# EAGLE design programming-board-rpi4 (EAGLE 9.6.2)
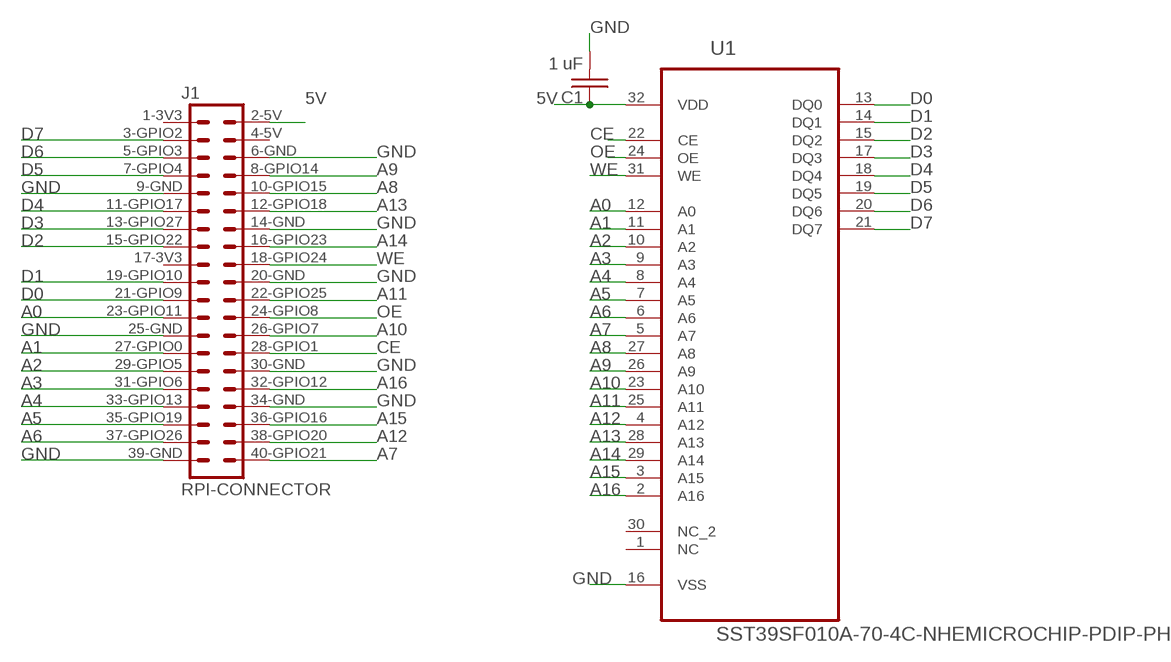
[diagram p0: schematic, sheet 1]

## Parts
C1  1 uF  C-USC1206K  [C1206K]
J1  RPI-CONNECTOR  [RPI-2X20]
U1  SST39SF010A-70-4C-NHEMICROCHIP-PDIP-PH  [DIP1574W53P254L4191H508Q32B]

## Nets
5V: C1.1 J1.2-5V(5V) U1.32(VDD)
A0: J1.23-GPIO11(GPIO11) U1.12(A0)
A1: J1.27-GPIO0(GPIO0) U1.11(A1)
A2: J1.29-GPIO5(GPIO5) U1.10(A2)
A3: J1.31-GPIO6(GPIO6) U1.9(A3)
A4: J1.33-GPIO13(GPIO13) U1.8(A4)
A5: J1.35-GPIO19(GPIO19) U1.7(A5)
A6: J1.37-GPIO26(GPIO26) U1.6(A6)
A7: J1.40-GPIO21(GPIO21) U1.5(A7)
A8: J1.10-GPIO15(GPIO15) U1.27(A8)
A9: J1.8-GPIO14(GPIO14) U1.26(A9)
A10: J1.26-GPIO7(GPIO7) U1.23(A10)
A11: J1.22-GPIO25(GPIO25) U1.25(A11)
A12: J1.38-GPIO20(GPIO20) U1.4(A12)
A13: J1.12-GPIO18(GPIO18) U1.28(A13)
A14: J1.16-GPIO23(GPIO23) U1.29(A14)
A15: J1.36-GPIO16(GPIO16) U1.3(A15)
A16: J1.32-GPIO12(GPIO12) U1.2(A16)
CE: J1.28-GPIO1(GPIO1) U1.22(CE)
D0: J1.21-GPIO9(GPIO9) U1.13(DQ0)
D1: J1.19-GPIO10(GPIO10) U1.14(DQ1)
D2: J1.15-GPIO22(GPIO22) U1.15(DQ2)
D3: J1.13-GPIO27(GPIO27) U1.17(DQ3)
D4: J1.11-GPIO17(GPIO17) U1.18(DQ4)
D5: J1.7-GPIO4(GPIO4) U1.19(DQ5)
D6: J1.5-GPIO3(GPIO3) U1.20(DQ6)
D7: J1.3-GPIO2(GPIO2) U1.21(DQ7)
GND: C1.2 J1.6-GND(GND) J1.9-GND(GND) J1.14-GND(GND) J1.20-GND(GND) J1.25-GND(GND) J1.30-GND(GND) J1.34-GND(GND) J1.39-GND(GND) U1.16(VSS)
OE: J1.24-GPIO8(GPIO8) U1.24(OE)
WE: J1.18-GPIO24(GPIO24) U1.31(WE)
Unconnected: U1.1(NC) U1.30(NC_2)

## Power pins joined to a net without a drawn wire
3V3: J1.1-3V3(3V3) J1.17-3V3(3V3)
5V: J1.4-5V(5V)

## Library data of the parts
C1 = passives:C-US: CAPACITOR, American symbol
J1 = hats:RPI-CONNECTOR: 0.1" spaced headers
U1 = memories:SST39SF010A-70-4C-NHE: 1MB Flash; DESCRIPTION: SST39SF Series 1 Mbit 128 K x 8 5 V Multi-Purpose Flash - PLCC-32; MP: SST39SF010A-70-4C-NHE

## Board
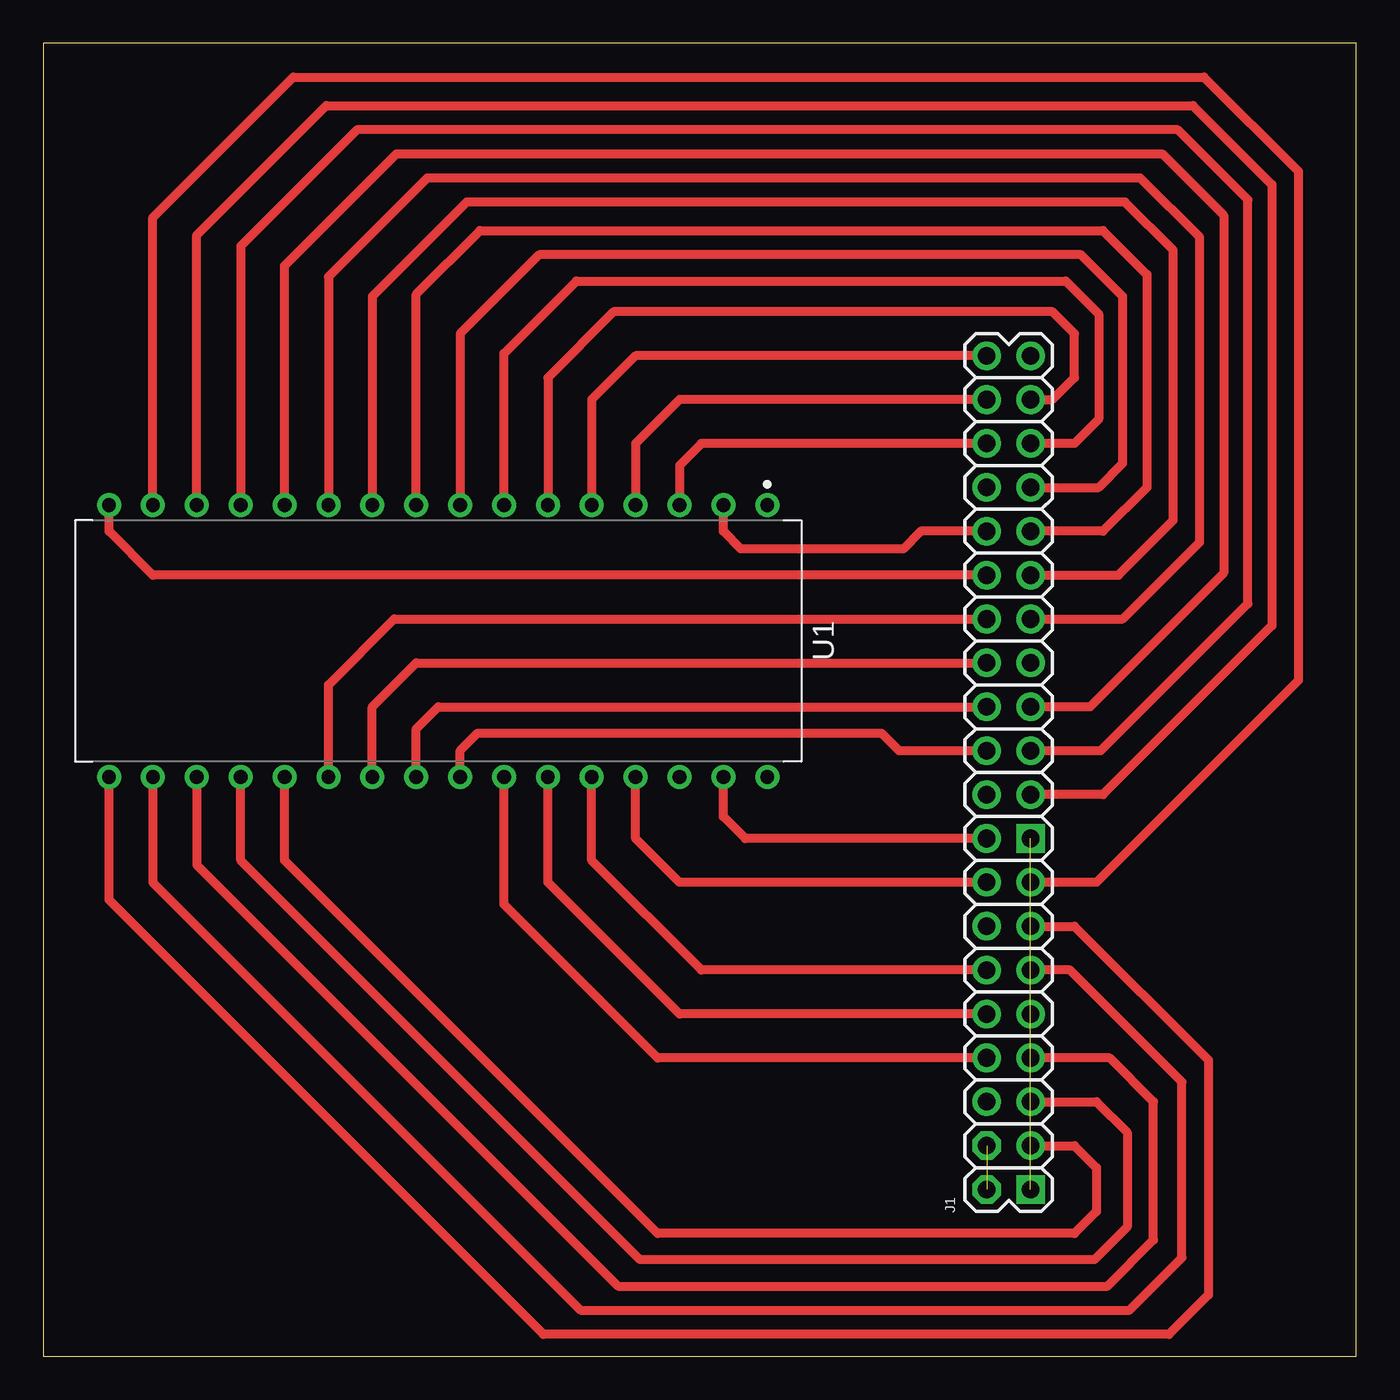
[diagram p1: board, top side]
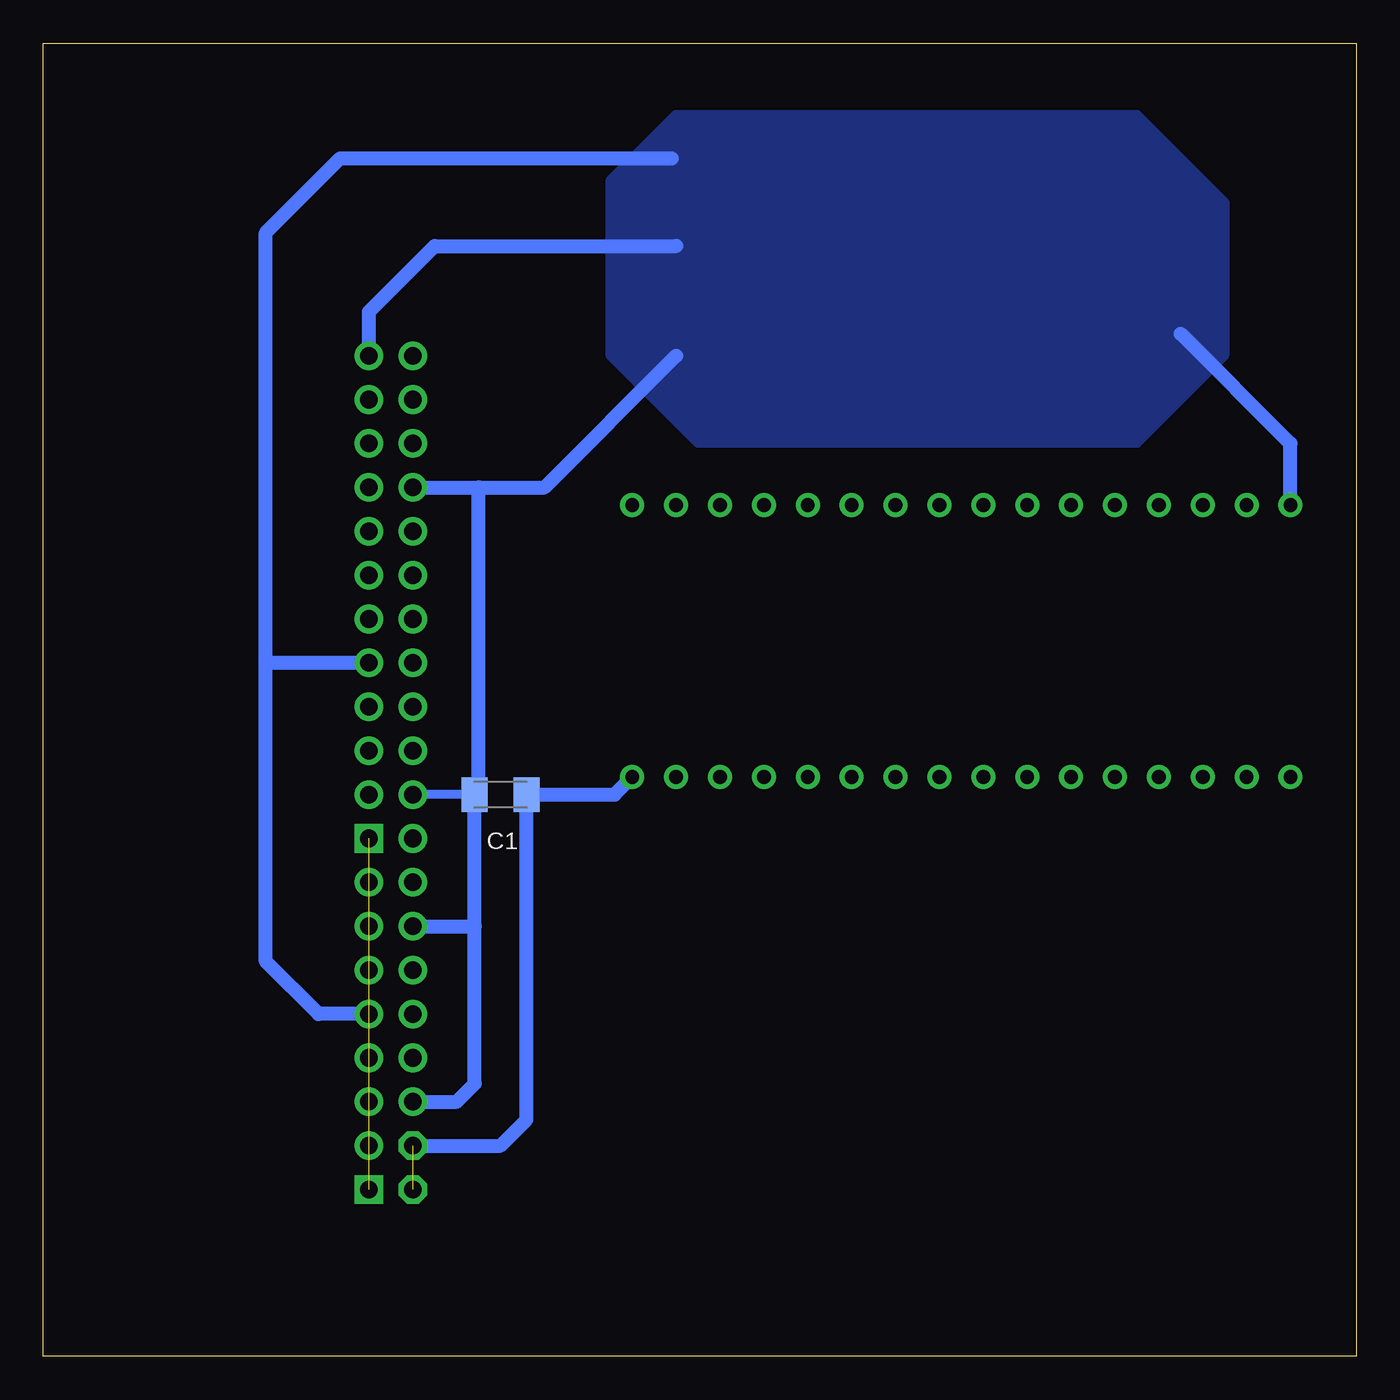
[diagram p2: board, bottom side, seen from below]

Size 76 x 76 mm. Coordinates in mm from the lower left corner, seen from the top.
Outline: 0,0 76,0 76,76 0,76 0,0
Copper layers (1*16): Top 0.035mm / dielectric 1.5mm / Bottom 0.035mm
Design rules "OthermillDRC_1_32_v2": minimum track width 8mil, minimum drill 0.8mm, track to track 0.794003125mm, track to pad 0.794003125mm, pad to pad 0.794003125mm, via to via 0.794003125mm, smd to smd 0mil, copper to edge 0mil, drill to drill 1mil, minimum pad ring 10mil, minimum via ring 10mil, stop-mask expansion 1mil, vias tented up to drill 30mil, thermal gap 10mil

### Footprints (pad centres in the part's own frame; a part is rotated, then mirrored left to right if it is on the bottom)
C1206K = smd 1.5 x 2: 1 -1.5,0; 2 1.5,0
RPI-2X20 = drill 1.016 pad 1.651 square: 1-3V3 -24.13,-1.27; 17-3V3 -3.81,-1.27 | drill 1.016 pad 1.651 octagon: 2-5V -24.13,1.27; 4-5V -21.59,1.27 | drill 1.016 pad 1.651: 3-GPIO2 -21.59,-1.27; 5-GPIO3 -19.05,-1.27; 6-GND -19.05,1.27; 7-GPIO4 -16.51,-1.27; 8-GPIO14 -16.51,1.27; 9-GND -13.97,-1.27; 10-GPIO15 -13.97,1.27; 11-GPIO17 -11.43,-1.27; 12-GPIO18 -11.43,1.27; 13-GPIO27 -8.89,-1.27; 14-GND -8.89,1.27; 15-GPIO22 -6.35,-1.27; 16-GPIO23 -6.35,1.27; 18-GPIO24 -3.81,1.27; 19-GPIO10 -1.27,-1.27; 20-GND -1.27,1.27; 21-GPIO9 1.27,-1.27; 22-GPIO25 1.27,1.27; 23-GPIO11 3.81,-1.27; 24-GPIO8 3.81,1.27; 25-GND 6.35,-1.27; 26-GPIO7 6.35,1.27; 27-GPIO0 8.89,-1.27; 28-GPIO1 8.89,1.27; 29-GPIO5 11.43,-1.27; 30-GND 11.43,1.27; 31-GPIO6 13.97,-1.27; 32-GPIO12 13.97,1.27; 33-GPIO13 16.51,-1.27; 34-GND 16.51,1.27; 35-GPIO19 19.05,-1.27; 36-GPIO16 19.05,1.27; 37-GPIO26 21.59,-1.27; 38-GPIO20 21.59,1.27; 39-GND 24.13,-1.27; 40-GPIO21 24.13,1.27
DIP1574W53P254L4191H508Q32B = drill 0.8 pad 1.388: 1 -7.874,19.05; 2 -7.874,16.51; 3 -7.874,13.97; 4 -7.874,11.43; 5 -7.874,8.89; 6 -7.874,6.35; 7 -7.874,3.81; 8 -7.874,1.27; 9 -7.874,-1.27; 10 -7.874,-3.81; 11 -7.874,-6.35; 12 -7.874,-8.89; 13 -7.874,-11.43; 14 -7.874,-13.97; 15 -7.874,-16.51; 16 -7.874,-19.05; 17 7.874,-19.05; 18 7.874,-16.51; 19 7.874,-13.97; 20 7.874,-11.43; 21 7.874,-8.89; 22 7.874,-6.35; 23 7.874,-3.81; 24 7.874,-1.27; 25 7.874,1.27; 26 7.874,3.81; 27 7.874,6.35; 28 7.874,8.89; 29 7.874,11.43; 30 7.874,13.97; 31 7.874,16.51; 32 7.874,19.05

### Placement (x,y rotation side)
C1  49.53,32.51 180 bottom
J1  55.88,33.78 90 top
U1  22.86,41.4 270 top

### Tracks (layer width: path | path; a pad name or v marks a point on that pad's centre or on a via)
3V3  (1 unrouted)
5V  (1 unrouted)
  Bottom 0.813: J1.4-5V 49.53,12.19 48.03,13.69 C1.1 42.93,32.51 U1.32
A0
  Top 0.508: U1.12 13.97,63.12 20.45,69.6 64.77,69.6 68.33,66.04 68.33,45.34 60.58,37.59 J1.23-GPIO11
A1
  Top 0.508: J1.27-GPIO0 62.48,42.67 66.93,47.12 66.93,64.77 63.5,68.2 22.23,68.2 16.51,62.48 U1.11
A2
  Top 0.508: J1.29-GPIO5 62.23,45.21 65.41,48.39 65.41,64.01 62.61,66.8 24.51,66.8 19.05,61.34 U1.10
A3
  Top 0.508: U1.9 21.59,61.47 25.27,65.15 61.34,65.15 63.88,62.61 63.88,50.29 61.34,47.75 J1.31-GPIO6
A4
  Top 0.508: J1.33-GPIO13 61.09,50.29 62.48,51.69 62.48,61.34 60.07,63.75 28.7,63.75 24.13,59.18 U1.8
A5
  Top 0.508: U1.7 26.67,58.04 30.86,62.23 59.18,62.23 61.09,60.33 61.09,54.23 59.69,52.83 J1.35-GPIO19
A6
  Top 0.508: J1.37-GPIO26 58.42,55.37 59.69,56.64 59.69,59.18 58.42,60.45 33.02,60.45 29.21,56.64 U1.6
A7
  Top 0.508: U1.5 31.75,55.37 34.29,57.91 J1.40-GPIO21
A8
  Top 0.508: J1.10-GPIO15 36.83,19.81 29.21,27.43 U1.27
A9
  Top 0.508: J1.8-GPIO14 35.56,17.27 26.67,26.16 U1.26
A10
  Top 0.508: U1.23 19.05,37.59 21.59,40.13 J1.26-GPIO7
A11
  Top 0.508: U1.25 24.13,35.05 25.15,36.07 48.51,36.07 49.53,35.05 J1.22-GPIO25
A12
  Top 0.508: U1.4 34.29,52.83 36.83,55.37 J1.38-GPIO20
A13
  Top 0.508: J1.12-GPIO18 38.1,22.35 31.75,28.7 U1.28
A14
  Top 0.508: U1.29 34.29,29.97 36.83,27.43 J1.16-GPIO23
A15
  Top 0.508: U1.3 36.83,51.56 38.1,52.83 J1.36-GPIO16
A16
  Top 0.508: U1.2 39.37,47.75 40.39,46.74 49.78,46.74 50.8,47.75 J1.32-GPIO12
CE
  Top 0.508: U1.22 16.51,38.86 20.32,42.67 J1.28-GPIO1
D0
  Top 0.508: J1.21-GPIO9 61.21,35.05 69.72,43.56 69.72,66.93 65.66,70.99 18.16,70.99 11.43,64.26 U1.13
D1
  Top 0.508: U1.14 8.89,64.9 16.38,72.39 66.55,72.39 71.12,67.82 71.12,42.29 61.34,32.51 J1.19-GPIO10
D2
  Top 0.508: U1.15 6.35,65.91 14.48,74.04 67.18,74.04 72.64,68.58 72.64,39.12 60.96,27.43 J1.15-GPIO22
D3
  Top 0.508: J1.13-GPIO27 59.69,24.89 67.44,17.14 67.44,3.56 65.15,1.27 28.96,1.27 3.81,26.42 U1.17
D4
  Top 0.508: J1.11-GPIO17 59.44,22.35 65.91,15.88 65.91,5.71 62.87,2.67 31.11,2.67 6.35,27.43 U1.18
D5
  Top 0.508: J1.7-GPIO4 61.72,17.27 64.26,14.73 64.26,6.73 61.59,4.06 33.27,4.06 8.89,28.45 U1.19
D6
  Top 0.508: J1.5-GPIO3 60.96,14.73 62.74,12.95 62.74,7.49 60.83,5.59 34.54,5.59 11.43,28.7 U1.20
D7
  Top 0.508: J1.3-GPIO2 59.69,12.19 60.96,10.92 60.96,8.38 59.69,7.11 35.56,7.11 13.97,28.7 U1.21
GND
  Top 0.508: J1.30-GND 6.35,45.21 3.81,47.75 U1.16
  Bottom 0.508: J1.20-GND C1.2 50.8,32.74
  Bottom 0.813: U1.16 3.81,52.83 10.16,59.18 | 39.37,57.91 46.99,50.29 50.8,50.29 | J1.34-GND 50.8,50.29 | J1.39-GND 57.15,60.45 53.34,64.26 39.37,64.26 | 50.8,32.74 50.8,50.29 | J1.6-GND 52.07,14.73 51.03,15.77 51.03,24.89 | 51.03,24.89 C1.2 | J1.14-GND 51.03,24.89 | J1.9-GND 60.07,19.81 63.12,22.86 63.12,40.13 | 63.12,40.13 63.12,65.02 58.8,69.34 39.62,69.34 | J1.25-GND 63.12,40.13
  pour Bottom: 7.62,66.8 7.62,57.91 12.7,52.83 38.1,52.83 43.18,57.91 43.18,68.07 39.37,71.88 12.7,71.88
OE
  Top 0.508: U1.24 21.59,36.32 22.86,37.59 J1.24-GPIO8
WE
  Top 0.508: J1.18-GPIO24 40.64,29.97 39.37,31.24 U1.31